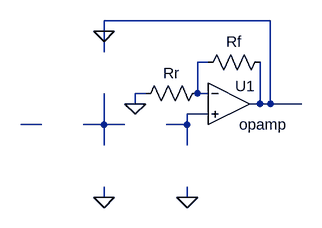
[diagram p0: schematic Active.asc]
Active.asc, the LTspice schematic file:
Version 4
SHEET 1 880 680
WIRE 256 -16 0 -16
WIRE 0 0 0 -16
WIRE 0 32 0 0
WIRE 160 48 144 48
WIRE 64 96 48 96
WIRE 144 96 144 48
WIRE 160 96 144 96
WIRE 48 112 48 96
WIRE 240 112 240 48
WIRE 240 112 224 112
WIRE 256 112 256 -16
WIRE 256 112 240 112
WIRE 304 112 256 112
WIRE 160 128 128 128
WIRE -96 144 -128 144
WIRE 0 144 0 96
WIRE 0 144 -32 144
WIRE 32 144 0 144
WIRE 128 144 128 128
WIRE 128 144 96 144
WIRE 0 176 0 144
WIRE 128 176 128 144
WIRE 0 256 0 240
WIRE 128 256 128 240
FLAG 48 112 0
FLAG 128 256 0
FLAG 0 256 0
FLAG 0 0 0
SYMBOL Opamps\\opamp 192 48 R0
WINDOW 0 10 37 Left 2
SYMATTR InstName U1
SYMBOL res 160 80 R90
WINDOW 0 0 56 VBottom 2
WINDOW 3 -52 239 VTop 2
SYMATTR InstName Rr
SYMATTR Value ""
SYMBOL res 256 32 R90
WINDOW 0 0 56 VBottom 2
WINDOW 3 -26 21 VTop 2
SYMATTR InstName Rf
SYMATTR Value ""

The netlist it stands for:
* Active.asc
XU1 N001 N002 0 opamp Aol=100K GBW=10Meg  ; pins invin noninvin out
Rr N001 0
Rf 0 N001
.backanno
.end